# EAGLE design menu-superlistas-tofi (EAGLE 5.11)
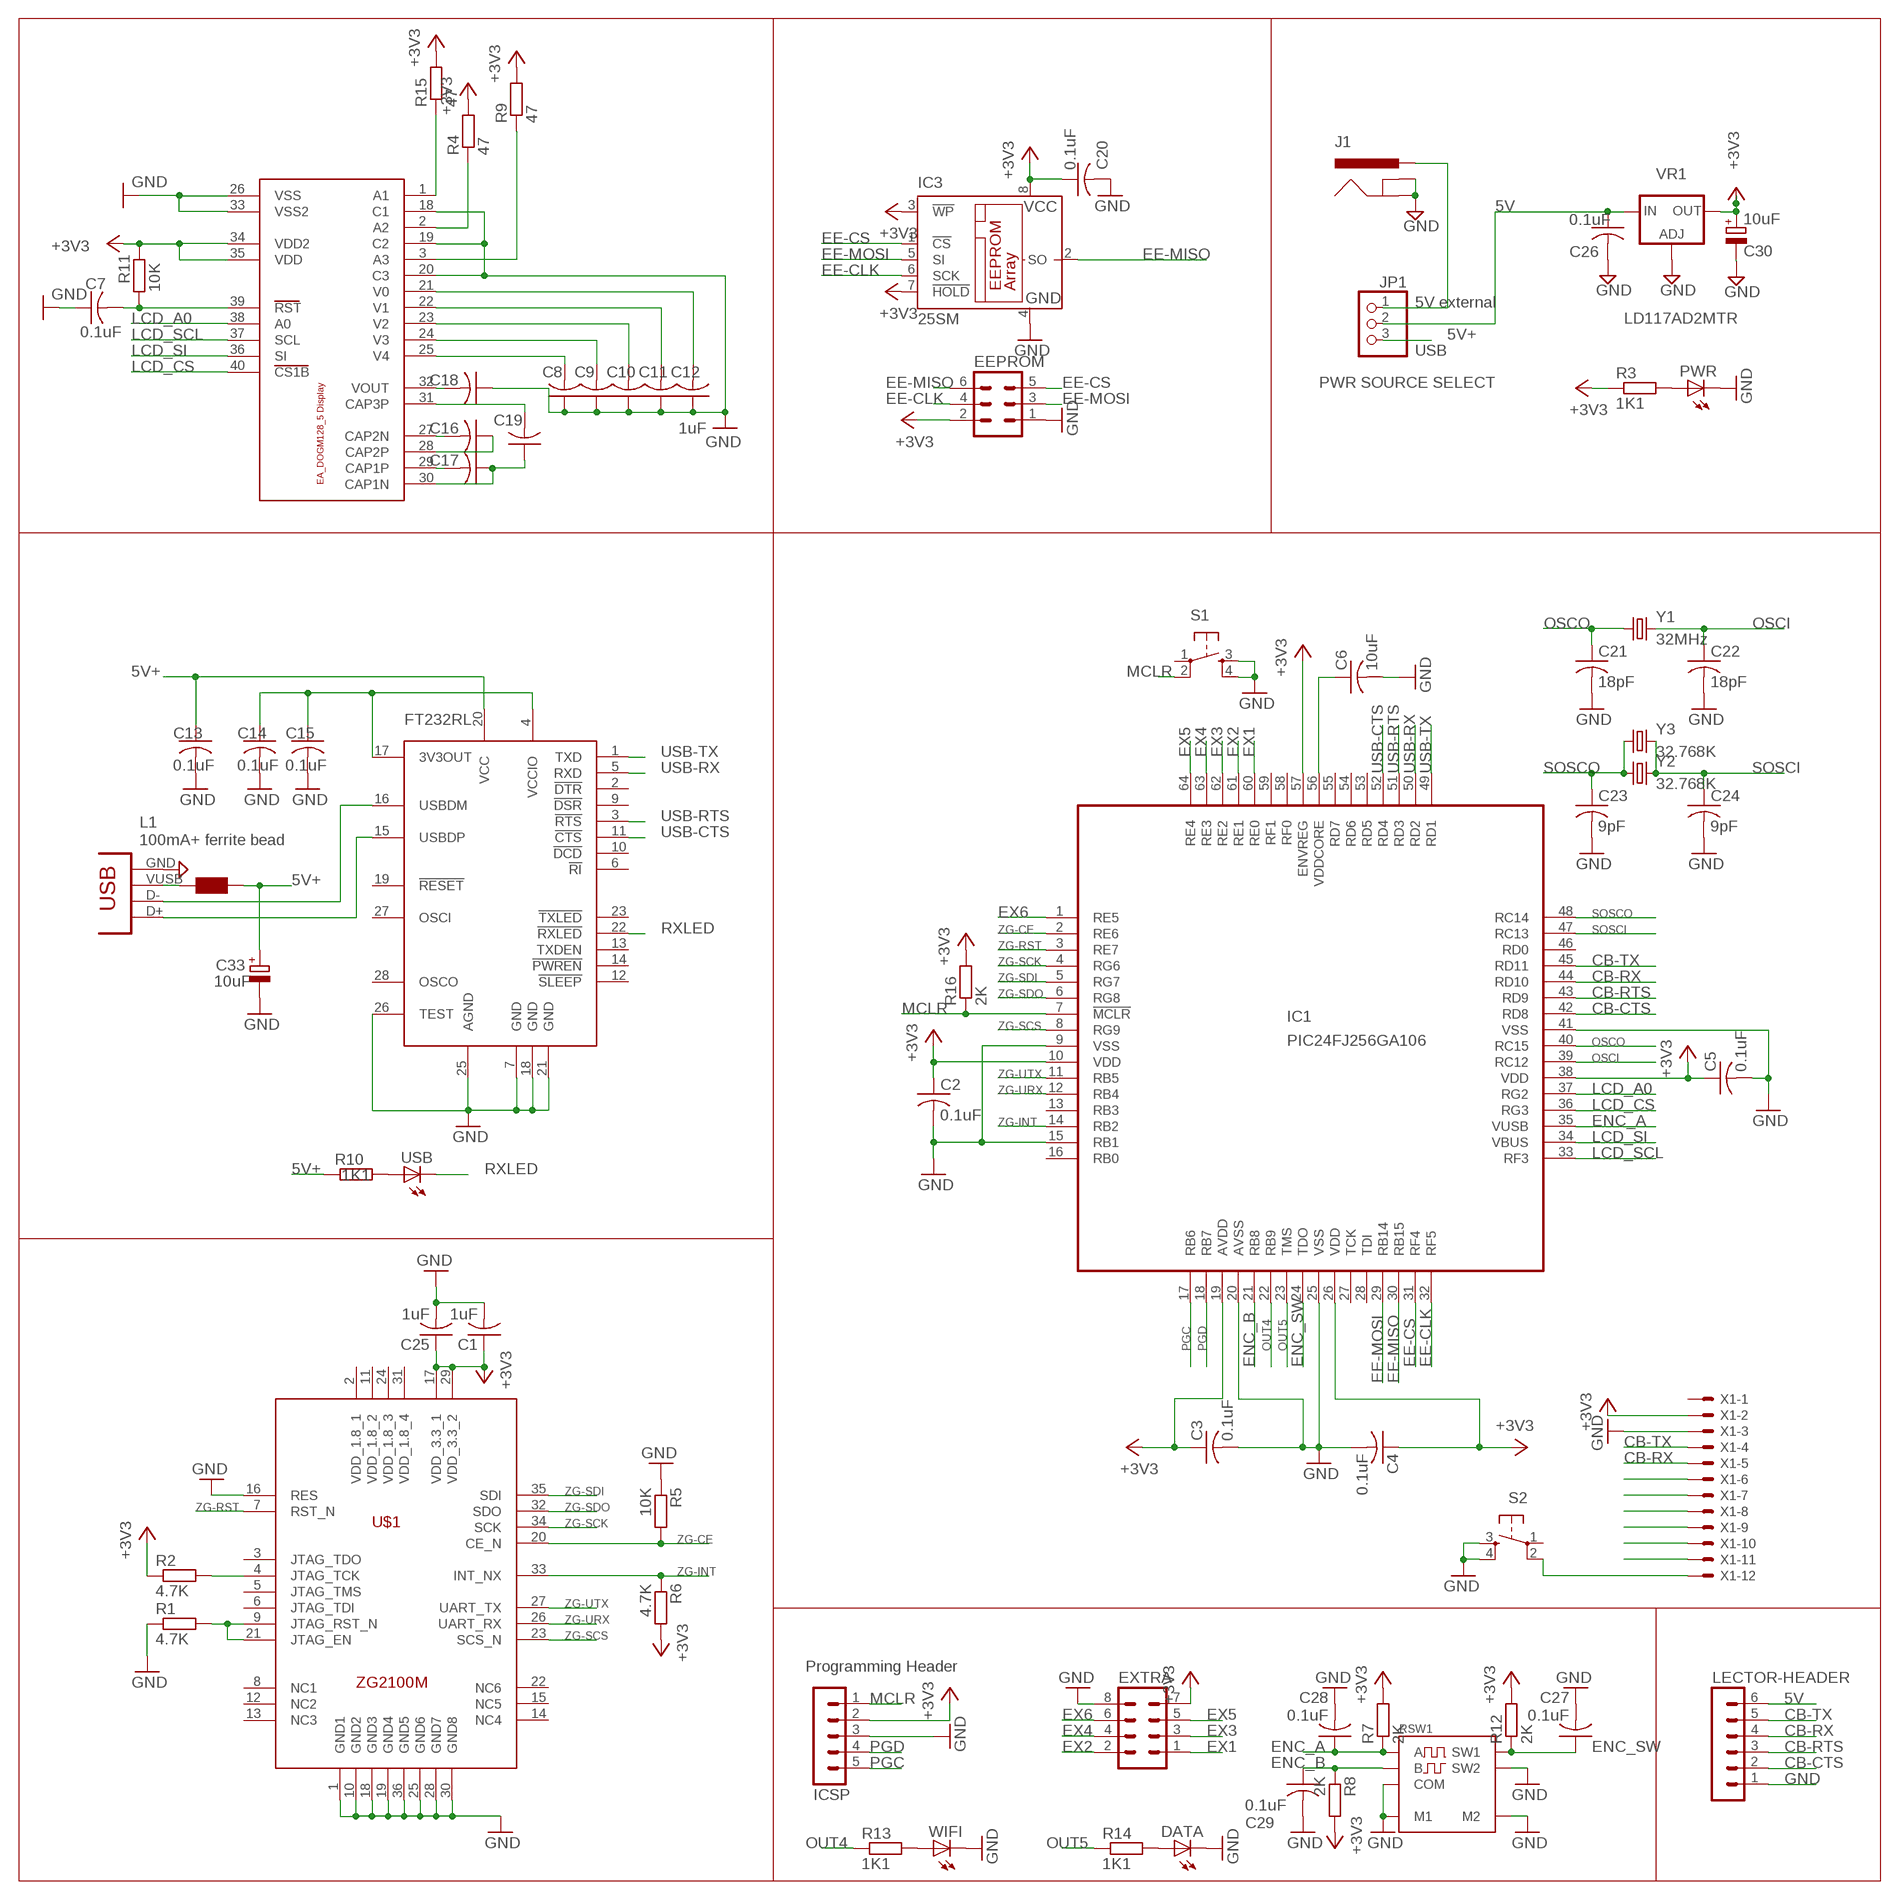
[diagram p0: schematic, sheet 1]

## Parts
C1  1uF  C-USC0805K  [C0805K]
C2  0.1uF  C-USC0805K  [C0805K]
C3  0.1uF  C-USC0805K  [C0805K]
C4  0.1uF  C-USC0805K  [C0805K]
C5  0.1uF  C-USC0805K  [C0805K]
C6  10uF  C-USC0805K  [C0805K]
C7  0.1uF  C-USC0805K  [C0805K]
C8  1uF  C-USC0805K  [C0805K]
C9  1uF  C-USC0805K  [C0805K]
C10  1uF  C-USC0805K  [C0805K]
C11  1uF  C-USC0805K  [C0805K]
C12  1uF  C-USC0805K  [C0805K]
C13  0.1uF  C-USC0805K  [C0805K]
C14  0.1uF  C-USC0805K  [C0805K]
C15  0.1uF  C-USC0805K  [C0805K]
C16  1uF  C-USC0805K  [C0805K]
C17  1uF  C-USC0805K  [C0805K]
C18  1uF  C-USC0805K  [C0805K]
C19  1uF  C-USC0805K  [C0805K]
C20  0.1uF  C-USC0805K  [C0805K]
C21  18pF  C-USC0805K  [C0805K]
C22  18pF  C-USC0805K  [C0805K]
C23  9pF  C-USC0805K  [C0805K]
C24  9pF  C-USC0805K  [C0805K]
C25  1uF  C-USC0805K  [C0805K]
C26  0.1uF  C-USC0805K  [C0805K]
C27  0.1uF  C-USC0805K  [C0805K]
C28  0.1uF  C-USC0805K  [C0805K]
C29  0.1uF  C-USC0805K  [C0805K]
C30  10uF  CPOL-EUSMCA  [SMC_A]
C33  10uF  CPOL-EUSMCA  [SMC_A]
CONN1  CONN_USB  [CONN_USB_MINI-B]
DATA  LEDCHIPLED_0805  [CHIPLED_0805]
EEPROM  MA03-2  [MA03-2]
EXTRA  MA04-2  [MA04-2]
IC1  PIC24FJ256GA106  PIC24FJ256GB106  [TQFP64-10X10]
IC3  25SM  [SO-08M]
IC4  FT232RL  [SSOP28]
ICSP  MA05-1  [MA05-1]
J1  POWER_JACKSMD  [POWER_JACK_SMD]
JP1  PINHD-1X03_2.54-S  [1X03-S]
L1  100mA+ ferrite bead  WE-KIL_0805  [WE-KI_0805_B]
LCD  EA_DOG-M_DISPLAY  [E_DOG-M_DISPLAY]
LECTOR-HEADER  MA06-1  [MA06-1]
PWR  LEDCHIPLED_0805  [CHIPLED_0805]
R1  4.7K  R-EU_R0805  [R0805]
R2  4.7K  R-EU_R0805  [R0805]
R3  1K1  R-EU_R0805  [R0805]
R4  47  R-EU_R0805  [R0805]
R5  10K  R-EU_R0805  [R0805]
R6  4.7K  R-EU_R0805  [R0805]
R7  2K  R-EU_R0805  [R0805]
R8  2K  R-EU_R0805  [R0805]
R9  47  R-EU_R0805  [R0805]
R10  1K1  R-EU_R0805  [R0805]
R11  10K  R-EU_R0805  [R0805]
R12  2K  R-EU_R0805  [R0805]
R13  1K1  R-EU_R0805  [R0805]
R14  1K1  R-EU_R0805  [R0805]
R15  47  R-EU_R0805  [R0805]
R16  2K  R-EU_R0805  [R0805]
RSW1  SW-EC11E  [EC11E]
S1  SMD_TACT_SMALL  [TACT_SWITCH_SMALL]
S2  SMD_TACT_SMALL  [TACT_SWITCH_SMALL]
U$1  ZG2100M  [ZG2100M]
USB  LEDCHIPLED_0805  [CHIPLED_0805]
VR1  LD117AD2MTR  [D2PACK]
WIFI  LEDCHIPLED_0805  [CHIPLED_0805]
X1  52745-1290  [52745-1290]
Y1  32MHz  TCX_7B_32TXC_7B_32  [TCX_7B_32]
Y2  32.768K  FSRLF  [FSRLF]
Y3  32.768K  ST325SB  [ST3215SB]

## Nets
5V [power]: C26.1 JP1.2 LECTOR-HEADER.6 VR1.3(IN)
5V+: C13.1 C33.+ IC4.20(VCC) JP1.3 L1.1 R10.2
$N26: CONN1.VUSB L1.2
+3V3 [power]: C1.1 C2.1 C3.1 C4.1 C5.1 C20.1 C25.1 C30.+ EEPROM.2 EXTRA.7 IC1.10(VDD) IC1.19(AVDD) IC1.26(VDD) IC1.38(VDD) IC1.57(ENVREG) IC3.3(!WP) IC3.7(!HOLD) IC3.8(VCC) ICSP.2 LCD.34(VDD2) LCD.35(VDD) R2.1 R3.1 R4.2 R6.2 R7.2 R8.2 R9.2 R11.2 R12.2 R15.2 R16.2 U$1.17(VDD_3.3_1) U$1.29(VDD_3.3_2) VR1.2(OUT) X1.2
CB-CTS: IC1.42(RD8) LECTOR-HEADER.2
CB-RTS: IC1.43(RD9) LECTOR-HEADER.3
CB-RX: IC1.44(RD10) LECTOR-HEADER.4 X1.5
CB-TX: IC1.45(RD11) LECTOR-HEADER.5 X1.4
EE-CLK: EEPROM.4 IC1.32(RF5) IC3.6(SCK)
EE-CS: EEPROM.5 IC1.31(RF4) IC3.1(!CS)
EE-MISO: EEPROM.6 IC1.30(RB15) IC3.2(SO)
EE-MOSI: EEPROM.3 IC1.29(RB14) IC3.5(SI)
ENC_A: C28.1 IC1.35(VUSB) R7.1 RSW1.A
ENC_B: C29.1 IC1.21(RB8) R8.1 RSW1.B
ENC_SW: C27.1 IC1.24(TDO) R12.1 RSW1.SW1
EX1: EXTRA.1 IC1.60(RE0)
EX2: EXTRA.2 IC1.61(RE1)
EX3: EXTRA.3 IC1.62(RE2)
EX4: EXTRA.4 IC1.63(RE3)
EX5: EXTRA.5 IC1.64(RE4)
EX6: EXTRA.6 IC1.1(RE5)
GND [power]: C1.2 C2.2 C3.2 C4.2 C5.2 C6.2 C7.1 C8.1 C9.1 C10.1 C11.1 C12.1 C13.2 C14.2 C15.2 C18.1 C20.2 C21.2 C22.2 C23.2 C24.2 C25.2 C26.2 C27.2 C28.2 C29.2 C30.- C33.- CONN1.GND DATA.C EEPROM.1 EXTRA.8 IC1.9(VSS) IC1.15(RB1) IC1.20(AVSS) IC1.25(VSS) IC1.41(VSS) IC3.4(GND) IC4.7(GND) IC4.18(GND) IC4.21(GND) IC4.25(AGND) IC4.26(TEST) ICSP.3 J1.GND(GNDBREAK) J1.P$4(GND) LCD.18(C1) LCD.19(C2) LCD.20(C3) LCD.26(VSS) LCD.33(VSS2) LECTOR-HEADER.1 PWR.C R1.1 R5.1 RSW1.C(COM) RSW1.M1 RSW1.M2 RSW1.SW2 S1.3 S1.4 S2.3 S2.4 U$1.1(GND1) U$1.10(GND2) U$1.16(RES) U$1.18(GND3) U$1.19(GND4) U$1.25(GND6) U$1.28(GND7) U$1.30(GND8) U$1.36(GND5) VR1.1(ADJ) WIFI.C X1.3
LCD_A0: IC1.37(RG2) LCD.38(A0)
LCD_CS: IC1.36(RG3) LCD.40(CS1B)
LCD_SCL: IC1.33(RF3) LCD.37(SCL)
LCD_SI: IC1.34(VBUS) LCD.36(SI)
MCLR: IC1.7(!MCLR) ICSP.1 R16.1 S1.2
N$1: R1.2 U$1.9(JTAG_RST_N) U$1.21(JTAG_EN)
N$2: PWR.A R3.2
N$3: R2.2 U$1.4(JTAG_TCK)
N$6: LCD.1(A1) R15.1
N$7: X1.6
N$8: X1.7
N$9 [power]: C6.1 IC1.56(VDDCORE)
N$10: LCD.2(A2) R4.1
N$11: R10.1 USB.A
N$12: C7.2 LCD.39(RST) R11.1
N$13: DATA.A R14.2
N$14: R13.2 WIFI.A
N$15: CONN1.D+ IC4.15(USBDP)
N$16: CONN1.D- IC4.16(USBDM)
N$17: C14.1 C15.1 IC4.4(VCCIO) IC4.17(3V3OUT)
N$18: LCD.3(A3) R9.1
N$19: X1.8
N$20: X1.9
N$21: C8.2 LCD.25(V4)
N$22: C9.2 LCD.24(V3)
N$23: C10.2 LCD.23(V2)
N$24: C11.2 LCD.22(V1)
N$25: C12.2 LCD.21(V0)
N$26: C16.2 LCD.27(CAP2N)
N$27: C16.1 LCD.28(CAP2P)
N$28: C17.2 LCD.29(CAP1P)
N$29: C17.1 C19.1 LCD.30(CAP1N)
N$30: C18.2 LCD.32(VOUT)
N$31: C19.2 LCD.31(CAP3P)
N$32: X1.10
N$33: X1.11
N$34: S2.2 X1.12
OSCI: C22.1 IC1.39(RC12) Y1.P$3
OSCO: C21.1 IC1.40(RC15) Y1.P$2
OUT4: IC1.22(RB9) R13.1
OUT5: IC1.23(TMS) R14.1
PGC: IC1.17(RB6) ICSP.5
PGD: IC1.18(RB7) ICSP.4
RXLED: IC4.22(!RXLED) USB.C
SOSCI: C24.1 IC1.47(RC13) Y2.P$4 Y3.P$2
SOSCO: C23.1 IC1.48(RC14) Y2.P$1 Y3.P$1
USB-CTS: IC1.52(RD4) IC4.11(!CTS)
USB-RTS: IC1.51(RD3) IC4.3(!RTS)
USB-RX: IC1.50(RD2) IC4.5(RXD)
USB-TX: IC1.49(RD1) IC4.1(TXD)
VEXT: J1.VIN0(PWR) JP1.1
ZG-CE: IC1.2(RE6) R5.2 U$1.20(CE_N)
ZG-INT: IC1.14(RB2) R6.1 U$1.33(INT_NX)
ZG-RST: IC1.3(RE7) U$1.7(RST_N)
ZG-SCK: IC1.4(RG6) U$1.34(SCK)
ZG-SCS: IC1.8(RG9) U$1.23(SCS_N)
ZG-SDI: IC1.5(RG7) U$1.35(SDI)
ZG-SDO: IC1.6(RG8) U$1.32(SDO)
ZG-URX: IC1.12(RB4) U$1.26(UART_RX)
ZG-UTX: IC1.11(RB5) U$1.27(UART_TX)
Unconnected: IC1.13(RB3) IC1.16(RB0) IC1.27(TCK) IC1.28(TDI) IC1.46(RD0) IC1.53(RD5) IC1.54(RD6) IC1.55(RD7) IC1.58(RF0) IC1.59(RF1) IC4.2(!DTR) IC4.6(!RI) IC4.9(!DSR) IC4.10(!DCD) IC4.12(!SLEEP) IC4.13(TXDEN) IC4.14(!PWREN) IC4.19(!RESET) IC4.23(!TXLED) IC4.27(OSCI) IC4.28(OSCO) S1.1 S2.1 U$1.2(VDD_1.8_1) U$1.3(JTAG_TDO) U$1.5(JTAG_TMS) U$1.6(JTAG_TDI) U$1.8(NC1) U$1.11(VDD_1.8_2) U$1.12(NC2) U$1.13(NC3) U$1.14(NC4) U$1.15(NC5) U$1.22(NC6) U$1.24(VDD_1.8_3) U$1.31(VDD_1.8_4) X1.1

## Notes on the sheet
- J1
- 5V external
- USB
- PWR SOURCE SELECT
- Programming Header

## Power pins joined to a net without a drawn wire
GND: Y1.P$1(GND) Y1.P$4(GND)

## Library data of the parts
C1 C3-C29 = rcl:C-US: CAPACITOR, American symbol
C2 = resistor:C-US: CAPACITOR, American symbol
C30 C33 = rcl:CPOL-EU: POLARIZED CAPACITOR, European symbol
CONN1 = dp_devices:CONN_USB: USB connector
DATA PWR USB WIFI = led:LED: LED OSRAM: - CHIPLED LG R971, LG N971, LY N971, LG Q971, LY Q971, LO R971, LY R971 LH N974, LH R974 LS Q976, LO Q976, LY Q976 LO Q996 - Hyper CHIPLED LW Q18S LB Q993, LB Q99A, LB R99A - SideLED LS A670, LO A670, LY A670, LG A670, LP A670 LB A673, LV A673, LT A673, LW A673 LH A674 LY A675 LS A676, LA A676, LO A676, LY A676, LW A676 LS A679, LY A679, LG A679 - Hyper Micro SIDELED® LS Y876, LA Y876, LO Y876, LY Y876 LT Y87S - SmartLED LW L88C, LW L88S LB L89C, LB L89S, LG L890 LS L89K, LO L89K, LY L89K LS L896, LA L896, LO L896, LY L896 - TOPLED LS T670, LO T670, LY T670, LG T670, LP T670 LSG T670, LSP T670, LSY T670, LOP T670, LYG T670 LG T671, LOG T671, LSG T671 LB T673, LV T673, LT T673, LW T673 LH T674 LS T676, LA T676, LO T676, LY T676, LB T676, LH T676, LSB T676, LW T676 LB T67C, LV T67C, LT T67C, LS T67K, LO T67K, LY T67K, LW E67C LS E67B, LA E67B, LO E67B, LY E67B, LB E67C, LV E67C, LT E67C LW T67C LS T679, LY T679, LG T679 LS T770, LO T770, LY T770, LG T770, LP T770 LB T773, LV T773, LT T773, LW T773 LH T774 LS E675, LA E675, LY E675, LS T675 LS T776, LA T776, LO T776, LY T776, LB T776 LHGB T686 LT T68C, LB T68C - Hyper Mini TOPLED® LB M676 - Mini TOPLED Santana® LG M470 LS M47K, LO M47K, LY M47K Source: http://www.osram.convergy.de LUXEON: - LUMILED® LXK2-PW12-R00, LXK2-PW12-S00, LXK2-PW14-U00, LXK2-PW14-V00 LXK2-PM12-R00, LXK2-PM12-S00, LXK2-PM14-U00 LXK2-PE12-Q00, LXK2-PE12-R00, LXK2-PE12-S00, LXK2-PE14-T00, LXK2-PE14-U00 LXK2-PB12-K00, LXK2-PB12-L00, LXK2-PB12-M00, LXK2-PB14-N00, LXK2-PB14-P00, LXK2-PB14-Q00 LXK2-PR12-L00, LXK2-PR12-M00, LXK2-PR14-Q00, LXK2-PR14-R00 LXK2-PD12-Q00, LXK2-PD12-R00, LXK2-PD12-S00 LXK2-PH12-R00, LXK2-PH12-S00 LXK2-PL12-P00, LXK2-PL12-Q00, LXK2-PL12-R00 Source: www.luxeon.com KINGBRIGHT: KA-3528ASYC Source: www.kingbright.com
EEPROM = con-lstb:MA03-2: PIN HEADER
EXTRA = con-lstb:MA04-2: PIN HEADER; OC_FARNELL: unknown; OC_NEWARK: unknown
IC1 = microchip:PIC24FJ256GB106: PIC24FJ256GB106 edit this description Auto generated by make-symbol-device-package-bsdl.ulp Rev. 25 Source: PIC24FJ256GB106.bsd; MPN: PIC24FJ256GB106-I/PT; OC_FARNELL: 1576868; OC_NEWARK: 54M5129
IC3 = microchip:25*: Serial EEPROM 4 K, SPI bus
IC4 = dp_devices:FT232RL: USB to serial UART interface
ICSP = con-lstb:MA05-1: PIN HEADER
J1 = SparkFun:POWER_JACK: Power Jack This is the standard 5.5mm barrel jack for power. The PTH is the most common, proven, reliable, footprint. All others are experimental. The Slot footprint only works if the mill layer is transmitted to the PCB fab house so be warned. Spark Fun Electronics SKU : PRT-00119. Mating wall wart : TOL-00298 (and others)
JP1 = pinhead-2:PINHD-1X03: PIN HEADER
L1 = wuerth-elektronik:WE-KIL: SMD Wire Wound Ceramic Inductor WE-KIL - Low profile - High Q values -- Bluetooth -- Wireless LAN -- RF oscillation circuit -- IF impedance matching
LCD = display_ea_dogm128:EA_DOG-M_DISPLAY
LECTOR-HEADER = con-lstb:MA06-1: PIN HEADER; OC_FARNELL: unknown; OC_NEWARK: unknown
R1-R16 = resistor:R-EU_: RESISTOR, European symbol
RSW1 = SuperListas:SW-EC11*
S1 S2 = dp_devices:SMD_TACT_SMALL
U$1 = SparkFun:ZG2100M
VR1 = v-reg:LD117A?*: Low drop fixed and adjustable positive voltage regulators 1 A Source: http://www.st.com/stonline/products/literature/ds/7194/ld1117axx.pdf
X1 = con-molex:52745-1290: FFC/FPC-to-Board 0.50mm (.020") SMT Top Contact Right Angle, ZIF, Style Receptacle 52745 / 52435 Source: http://www.molex.com/product/ffc/52745.html; MPN: 52745-1290; OC_FARNELL: unknown; OC_NEWARK: 92M6383
Y1 = SuperListas:TCX_7B_32
Y2 = SuperListas:FSRLF
Y3 = SuperListas:ST325SB

## Net classes
1 power: width 0.254 mm

## Board
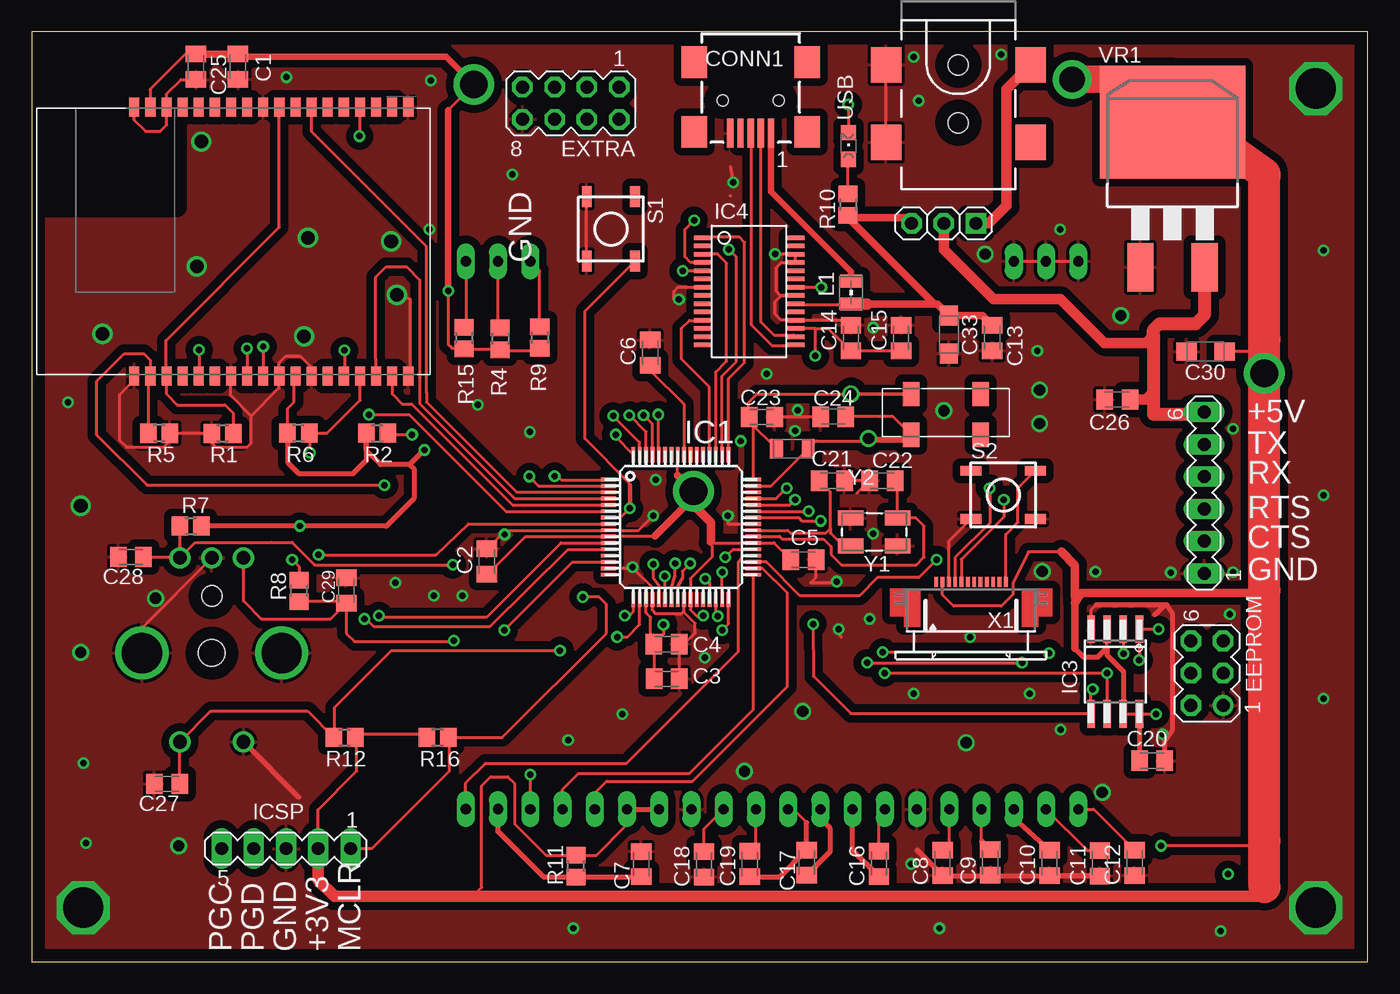
[diagram p1: board, top side]
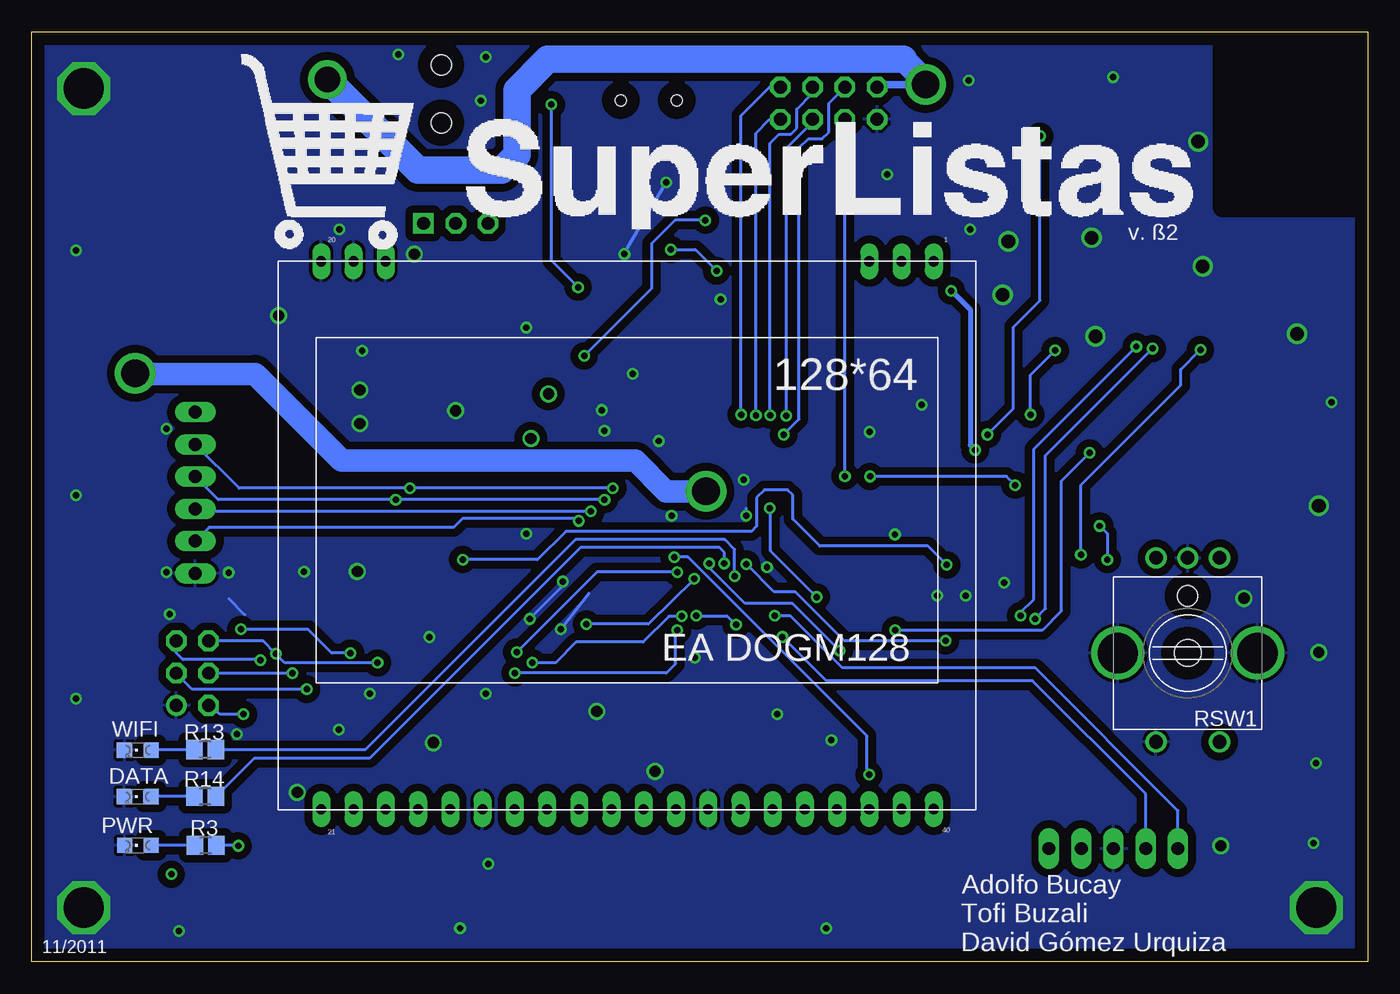
[diagram p2: board, bottom side, seen from below]

Size 105.28 x 73.29 mm. Coordinates in mm from the lower left corner, seen from the top.
Outline: 0,0 105.28,0 105.28,73.29 0,73.29 0,0
Copper layers (1*16): Top 0.035mm / dielectric 1.5mm / Bottom 0.035mm
Design rules "default *": minimum track width 7mil, minimum drill 20mil, track to track 7mil, track to pad 7mil, pad to pad 7mil, via to via 7mil, smd to smd 7mil, copper to edge 40mil, drill to drill 8mil, minimum pad ring 12mil, minimum via ring 8mil, stop-mask expansion 7mil, vias tented up to drill 25mil, thermal gap 10mil
tRestrict: area 0.1,59.5 to 11.4,80.1
bRestrict: area 0.1,59.5 to 11.4,80.1

### Footprints (pad centres in the part's own frame; a part is rotated, then mirrored left to right if it is on the bottom)
C0805K = smd 1.3 x 1.6: 1 -1,0; 2 1,0
SMC_A = smd 1.6 x 1.4: + -1.5,0; - 1.5,0
CONN_USB_MINI-B = smd 0.5 x 2.3: D+ 0,2.6; D- -0.8,2.6; GND 1.6,2.6; P4 0.8,2.6; VUSB -1.6,2.6 | smd 2 x 2.5: PC1 -4.45,2.5; PC2 4.45,2.5; PC3 4.45,-3; PC4 -4.45,-3 | hole 0.9: -2.2,0; 2.2,0
CHIPLED_0805 = smd 1.2 x 1.2: A 0,-1.05; C 0,1.05
MA03-2 = drill 1.016 round: 1 -2.54,-1.27 | drill 1.016 octagon: 2 -2.54,1.27; 3 0,-1.27; 4 0,1.27; 5 2.54,-1.27; 6 2.54,1.27
MA04-2 = drill 1.016 octagon: 1 -3.81,-1.27; 2 -3.81,1.27; 3 -1.27,-1.27; 4 -1.27,1.27; 5 1.27,-1.27; 6 1.27,1.27; 7 3.81,-1.27; 8 3.81,1.27
TQFP64-10X10 = smd 1.2 x 0.3: 1 -5.7,3.75; 2 -5.7,3.25; 3 -5.7,2.75; 4 -5.7,2.25; 5 -5.7,1.75; 6 -5.7,1.25; 7 -5.7,0.75; 8 -5.7,0.25; 9 -5.7,-0.25; 10 -5.7,-0.75; 11 -5.7,-1.25; 12 -5.7,-1.75; 13 -5.7,-2.25; 14 -5.7,-2.75; 15 -5.7,-3.25; 16 -5.7,-3.75; 33 5.7,-3.75; 34 5.7,-3.25; 35 5.7,-2.75; 36 5.7,-2.25; 37 5.7,-1.75; 38 5.7,-1.25; 39 5.7,-0.75; 40 5.7,-0.25; 41 5.7,0.25; 42 5.7,0.75; 43 5.7,1.25; 44 5.7,1.75; 45 5.7,2.25; 46 5.7,2.75; 47 5.7,3.25; 48 5.7,3.75 | smd 0.3 x 1.2: 17 -3.75,-5.7; 18 -3.25,-5.7; 19 -2.75,-5.7; 20 -2.25,-5.7; 21 -1.75,-5.7; 22 -1.25,-5.7; 23 -0.75,-5.7; 24 -0.25,-5.7; 25 0.25,-5.7; 26 0.75,-5.7; 27 1.25,-5.7; 28 1.75,-5.7; 29 2.25,-5.7; 30 2.75,-5.7; 31 3.25,-5.7; 32 3.75,-5.7; 49 3.75,5.7; 50 3.25,5.7; 51 2.75,5.7; 52 2.25,5.7; 53 1.75,5.7; 54 1.25,5.7; 55 0.75,5.7; 56 0.25,5.7; 57 -0.25,5.7; 58 -0.75,5.7; 59 -1.25,5.7; 60 -1.75,5.7; 61 -2.25,5.7; 62 -2.75,5.7; 63 -3.25,5.7; 64 -3.75,5.7
SO-08M = smd 0.6 x 2.2: 1 -1.905,-3.33; 2 -0.635,-3.33; 3 0.635,-3.33; 4 1.905,-3.33; 5 1.905,3.33; 6 0.635,3.33; 7 -0.635,3.33; 8 -1.905,3.33
SSOP28 = smd 0.348 x 1.397: 1 -4.225,-3.656; 2 -3.575,-3.656; 3 -2.925,-3.656; 4 -2.275,-3.656; 5 -1.625,-3.656; 6 -0.975,-3.656; 7 -0.325,-3.656; 8 0.325,-3.656; 9 0.975,-3.656; 10 1.625,-3.656; 11 2.275,-3.656; 12 2.925,-3.656; 13 3.575,-3.656; 14 4.225,-3.656; 15 4.225,3.656; 16 3.575,3.656; 17 2.925,3.656; 18 2.275,3.656; 19 1.625,3.656; 20 0.975,3.656; 21 0.325,3.656; 22 -0.325,3.656; 23 -0.975,3.656; 24 -1.625,3.656; 25 -2.275,3.656; 26 -2.925,3.656; 27 -3.575,3.656; 28 -4.225,3.656
MA05-1 = drill 1.016 long: 1 -5.08,0; 2 -2.54,0; 3 0,0; 4 2.54,0; 5 5.08,0
POWER_JACK_SMD = smd 2.8 x 2.4: GND 0,-5.7; P$4 6.1,-5.7; VIN0 0,5.7; VIN1 6.1,5.7 | hole 1.6: 0,0; 4.572,0
1X03-S = drill 1.016 square: 1 -2.54,0 | drill 1.016 octagon: 2 0,0; 3 2.54,0
WE-KI_0805_B = smd 1.02 x 1.78: 1 -0.89,0; 2 0.89,0
E_DOG-M_DISPLAY = drill 0.8 long: 1 -22.828,-20.32; 2 -20.288,-20.32; 3 -17.748,-20.32; 18 20.352,-20.32; 19 22.892,-20.32; 20 25.432,-20.32; 21 25.432,22.86; 22 22.892,22.86; 23 20.352,22.86; 24 17.812,22.86; 25 15.272,22.86; 26 12.732,22.86; 27 10.192,22.86; 28 7.652,22.86; 29 5.112,22.86; 30 2.572,22.86; 31 0.032,22.86; 32 -2.508,22.86; 33 -5.048,22.86; 34 -7.588,22.86; 35 -10.128,22.86; 36 -12.668,22.86; 37 -15.208,22.86; 38 -17.748,22.86; 39 -20.288,22.86; 40 -22.828,22.86
MA06-1 = drill 1.016 long: 1 -6.35,0; 2 -3.81,0; 3 -1.27,0; 4 1.27,0; 5 3.81,0; 6 6.35,0
R0805 = smd 1.3 x 1.5: 1 -0.85,0; 2 0.85,0
EC11E = drill 1.067 pad 1.676 round: A -2.5,-7.5; B 2.5,-7.5; C 0,-7.5; SW1 -2.5,7; SW2 2.5,7 | drill 3.175 round: M1 -5.5,0; M2 5.5,0 | hole 1.6: 0,-4.5 | hole 2.1: 0,0
TACT_SWITCH_SMALL = smd 1.651 x 0.762: 1 -2.54,1.905; 2 2.54,1.905; 3 -2.54,-1.905; 4 2.54,-1.905
ZG2100M = smd 1.5 x 0.8: 1 21.1,1.7; 2 21.1,2.97; 3 21.1,4.24; 4 21.1,5.51; 5 21.1,6.78; 6 21.1,8.05; 7 21.1,9.32; 8 21.1,10.59; 9 21.1,11.86; 10 21.1,13.13; 11 21.1,14.4; 12 21.1,15.67; 13 21.1,16.94; 14 21.1,18.21; 15 21.1,19.48; 16 21.1,20.75; 17 21.1,22.02; 18 21.1,23.29; 19 -0.1,23.29; 20 -0.1,22.02; 21 -0.1,20.75; 22 -0.1,19.48; 23 -0.1,18.21; 24 -0.1,16.94; 25 -0.1,15.67; 26 -0.1,14.4; 27 -0.1,13.13; 28 -0.1,11.86; 29 -0.1,10.59; 30 -0.1,9.32; 31 -0.1,8.05; 32 -0.1,6.78; 33 -0.1,5.51; 34 -0.1,4.24; 35 -0.1,2.97; 36 -0.1,1.7
D2PACK = smd 2.083 x 3.81: 1 -2.54,-8.89; 3 2.54,-8.89 | smd 11.43 x 8.89: 2 0,2.54
52745-1290 = smd 0.3 x 0.8: 1 -2.75,2.5; 2 -2.25,2.5; 3 -1.75,2.5; 4 -1.25,2.5; 5 -0.75,2.5; 6 -0.25,2.5; 7 0.25,2.5; 8 0.75,2.5; 9 1.25,2.5; 10 1.75,2.5; 11 2.25,2.5; 12 2.75,2.5
TCX_7B_32 = smd 2 x 1.2: P$1 -1.85,1.1; P$2 1.85,1.1; P$3 -1.85,-1.1; P$4 1.85,-1.1
FSRLF = smd 1.3 x 1.9: P$1 -2.54,1.27; P$2 2.94,1.27; P$3 2.94,-1.94; P$4 -2.54,-1.94
ST3215SB = smd 1 x 1.55: P$1 -1.25,0; P$2 1.25,0

### Placement (x,y rotation side)
C1  16.25,70.56 270 top
C2  35.86,31.55 90 top
C3  50.04,22.31 0 top
C4  50.04,25.04 0 top
C5  60.8,31.69 0 top
C6  48.74,48.01 90 top
C7  48.03,7.7 270 top
C8  71.77,7.8 90 top
C9  75.53,7.83 90 top
C10  80.2,7.79 90 top
C11  84.17,7.77 90 top
C12  86.9,7.81 90 top
C13  75.69,49.17 270 top
C14  64.56,49.17 90 top
C15  68.5,49.17 90 top
C16  66.76,7.73 90 top
C17  61.07,7.82 270 top
C18  52.97,7.68 90 top
C19  56.58,7.71 90 top
C20  88.29,15.85 0 top
C21  63.06,37.92 0 top
C22  67.02,37.91 180 top
C23  57.54,42.94 0 top
C24  63.16,42.97 180 top
C25  12.94,70.54 270 top
C26  85.55,44.32 180 top
C27  10.67,14.02 180 top
C28  7.82,31.9 180 top
C29  24.79,29.26 90 top
C30  92.49,48.1 180 top
C33  72.28,49.44 270 top
CONN1  56.66,67.9 180 top
DATA  96.93,13.02 90 bottom
EEPROM  92.62,22.75 90 top
EXTRA  42.48,67.67 180 top
IC1  51.16,34.26 0 top
IC3  85.37,22.88 180 top
IC4  56.53,52.84 270 top
ICSP  20.04,8.92 180 top
J1  73.01,70.7 270 top
JP1  71.87,58.2 180 top
L1  64.57,52.74 90 top
LCD  57.03,34.89 180 bottom
LECTOR-HEADER  92.39,36.97 90 top
PWR  96.92,9.18 90 bottom
R1  15.04,41.65 0 top
R2  27.22,41.66 0 top
R3  91.59,9.17 180 bottom
R4  36.92,49.1 270 top
R5  10.04,41.66 180 top
R6  21.01,41.66 180 top
R7  12.54,34.35 0 top
R8  21.07,29.23 90 top
R9  40.04,49.19 270 top
R10  64.33,59.66 270 top
R11  42.89,7.55 90 top
R12  24.66,17.68 0 top
R13  91.61,16.72 180 bottom
R14  91.61,13.03 180 bottom
R15  34.07,49.16 270 top
R16  31.99,17.67 180 top
RSW1  14.19,24.33 180 bottom
S1  45.63,57.76 270 top
S2  76.56,36.8 0 top
U$1  31.38,46.27 90 top
USB  64.36,64.3 0 top
VR1  89.9,63.62 0 top
WIFI  96.92,16.69 90 bottom
X1  74.02,27.43 0 top
Y1  66.38,33.88 180 top
Y2  71.84,43.48 0 top
Y3  59.94,40.44 0 top

### Tracks (layer width: path | path; a pad name or v marks a point on that pad's centre or on a via)
5V
  Top 0.61: 89.41,50.29 89.31,50.19 | 88.39,43.16 88.39,43.15 | 88.39,49.17 87.99,48.77
  Top 0.813: 88.39,49.38 87.78,48.77 84.53,48.77 81.08,52.22 75.79,52.22 71.87,56.15 JP1.2 | C26.1 87.8,44.32 88.39,44.91
  Top 1.016: VR1.3 92.44,51.01 91.72,50.29 89.41,50.29 88.88,50.29 88.39,49.81 88.39,49.38 88.39,49.17 88.39,44.91 88.39,43.16 92.39,43.16 LECTOR-HEADER.6
5V+
  Top 0.254: IC4.20 60.7,51.86 60.75,51.81 64.53,51.81 L1.1
  Top 0.61: C13.1 74.92,50.94 C33.+ 71.37,51.85 71.12,51.85 | 65.8,51.85 71.12,51.85 | 64.33,58.64 R10.2 | 71.12,51.85 64.33,58.64 | 64.33,58.64 68.89,58.64 JP1.3
  Top 0.914: L1.1 65.8,51.85
$N26
  Top 0.508: L1.2 64.57,54.42 58.27,60.72 58.27,65.49 CONN1.VUSB
+3V3  (via drill 0.51, 0.51 pad 0.25, 2.03 pad 0.25, 2.18, 2.18 pad 0.25)
  Top 0.254: IC3.7 IC3.8 | IC1.38 58.48,33.01 C5.1 59.8,31.26 | IC3.8 88.55,19.55 v88.59,19.51 | 84.73,24.74 IC3.3 | 87.29,16.56 C20.1 | IC3.8 | 22.61,7.73 ICSP.2 22.55,8.94 22.55,11.99 25.6,15.04 25.6,17.59 R12.2 25.6,17.97 30.84,17.97 R16.2 31.03,17.97 | C3.1 C4.1 | IC1.19 48.41,27.51 48.77,27.15 48.77,25.31 C4.1 | v52.91,27.28 52.43,27.28 | v52.91,27.28 52.98,27.28 | v49.78,26.57 49.78,25.79 C4.1 | 35.18,5.16 35.28,5.36 | IC1.57 50.91,38.32 | 49.12,33.55 49.12,33.53 45.53,33.53 IC1.10 45.42,33.48 38.86,33.48 35.99,30.6 C2.1 35.39,30.08 | 82.22,28.52 82.22,28.8 | IC1.38 58.51,33.01 59.97,31.55 | 97.13,29.29 96.95,29.11 | 96.09,49.15 96.09,49.51 | C30.+ 96.18,48.1 97.13,49.05 | 97.13,62.11 97.13,61.91 | IC1.38 53.71,33.01 53.54,33.18 | 53.37,33.01 53.62,32.77 53.62,31.92 51.9,30.2 IC1.26 51.91,27.75 52.43,27.23 52.86,27.23 v52.91,27.28 | U$1.29 20.68,46.06 20.68,44.12 20.16,43.61 R6.2 20.22,41.6 | C25.1 12.1,71.54 9.32,68.76 9.32,67.4 U$1.17 | X1.2 71.77,28.92 72.64,28.04 76.4,28.04 77.32,28.96 77.32,29.87 78.54,32.31 81.1,32.31 81.13,32.33 | R8.2 21.07,31.15 v20.52,31.7 | 90.07,69.55 89.61,69.49 89.61,67.99 89.9,67.46 | LCD.35 46.9,10.74 46.84,10.74 44.49,8.39 R11.2 40.52,8.39 38.05,10.87 38.05,14.05 37.52,14.58 36.17,14.58 35.46,13.87 35.46,5.86 34.75,5.15 | 34.09,68.38 32.82,67.11 | R9.2 39.85,48.16 36.37,48.16 36.47,48.25 R4.2 36.87,48.31 R15.2 34.02,48.36 33.12,48.36 32.82,48.67 v32.82,52.88 | v89,9.14 96.93,9.14 97.13,9.55 | 96.9,5.18 97.1,5.66 97.13,5.89
  Top 0.406: IC3.7 86.01,22.91 84.73,24.18 84.73,24.74 84.02,24.03 82.88,24.03 82.22,24.69 | IC3.8 87.29,16.56 | LCD.35 LCD.34 | v34.85,69.14 34.82,69.11 | 97.13,45.87 96.09,49.15 | 53.54,33.18 53.37,33.01 | 97.13,28.3 96.62,29.06 | 20.22,41.6 20.22,39.32 21.08,38.46 25.3,38.46 26.37,39.53 R2.1 26.37,40.31 27.48,39.19 29.79,39.19 | v30.94,40.34 29.79,39.19 | 29.79,39.19 30.12,38.86 30.12,36.52 27.95,34.35 v21.13,34.35 R7.2
  Top 0.508: 34.09,68.38 v34.85,69.14 32.64,71.35 16.54,71.35 | 32.82,67.11 v32.82,52.88
  Top 0.61: 82.22,24.69 82.22,28.3 82.22,28.52 | VR1.2 89.9,67.46 89.9,69.97 | 50.91,38.32 v52.15,37.08 52.15,36.58 49.12,33.55 | C25.1 16.35,71.54 16.54,71.35 15.96,71.35 C1.1
  Top 0.66: 52.15,36.58 52.15,36.02 53.54,34.62 53.54,33.18 | 96.62,29.06 82.73,29.06 82.22,28.3 | 82.22,28.8 82.22,31.24 81.13,32.33
  Top 0.914: 96.9,5.18 35.18,5.16 35.17,5.15 34.75,5.15 23.87,5.15 22.58,6.44 ICSP.2
  Top 1.27: 90.22,66.17 VR1.2
  Top 2.184: 90.07,69.55 v81.99,69.55
  Top 2.54: 91.44,66.17 90.22,66.17 | 91.44,66.17 91.75,66.17 | 97.13,61.91 97.13,49.05 v97.13,46.38 97.13,45.87 97.13,29.29 97.13,28.3 97.13,9.55 97.13,5.89 | 97.13,62.11 91.44,66.17
  Bottom 0.254: v88.59,19.51 90.39,19.51 EEPROM.2 | v52.91,27.28 50.49,27.28 v49.78,26.57 | 38.47,69.14 EXTRA.7 | v20.52,31.7 20.52,33.74 v21.13,34.35 | R3.1 89.03,9.17 v89,9.14
  Bottom 0.406: v30.94,40.34 31.33,40.73 31.33,51.4 v32.82,52.88
  Bottom 0.61: v34.85,69.14 38.47,69.14
  Bottom 1.778: v52.15,37.08 55.3,37.08 57.71,39.5 80.85,39.5 87.68,46.33 97.38,46.33 v97.13,46.38
  Bottom 1.93: 36.58,71.12 34.85,69.39 v34.85,69.14
  Bottom 2.184: v81.99,69.55 74.83,62.38 68.28,62.38 67.06,63.6 67.06,68.68 64.62,71.12 36.58,71.12
CB-CTS  (via drill 0.51)
  Top 0.254: IC1.42 60.44,35.01 60.71,34.75 v62.18,34.75
  Bottom 0.254: LECTOR-HEADER.2 91.31,34.24 72.03,34.24 71.32,34.95 62.38,34.95 v62.18,34.75
CB-RTS  (via drill 0.51)
  Top 0.254: IC1.43 61.41,35.51 v61.21,35.51
  Bottom 0.254: v61.21,35.51 92.2,35.51 LECTOR-HEADER.3
CB-RX  (via drill 0.51)
  Top 0.254: IC1.44 59.73,36.01 v60.15,36.42 | X1.5 73.26,29.94 73.26,31.72 76.61,35.06 v76.61,36.42
  Bottom 0.254: LECTOR-HEADER.4 90.57,36.42 v76.61,36.42 v60.15,36.42
CB-TX  (via drill 0.51, 0.51 pad 0.61)
  Top 0.254: IC1.45 58.66,36.51 v59.49,37.34 | X1.4 72.8,29.97 | v75.49,37.34 75.49,34.57 72.77,31.85 X1.4 | X1.4 72.79,29.96
  Bottom 0.254: LECTOR-HEADER.5 88.95,37.34 v75.49,37.34 v59.49,37.34
EE-CLK  (via drill 0.51, 0.51 pad 0.25)
  Top 0.254: IC3.6 v84.73,22.76 v67.21,22.76 | IC1.32 54.91,26.64 v54.41,26.14
  Bottom 0.254: EEPROM.4 84.74,22.75 v84.73,22.76 | v54.41,26.14 54.53,26.14 54.53,23.5 55.27,22.76 v67.21,22.76
EE-CS  (via drill 0.51)
  Top 0.254: v87.27,23.77 IC3.1 v88.8,26.21 | IC1.31 54.41,30.48 v54.41,30.71 | v67.06,24.41 80.09,24.41 v80.16,24.33
  Bottom 0.254: EEPROM.5 93.89,24.34 93.37,23.82 87.33,23.82 v87.27,23.77 | v54.41,30.71 60.73,30.73 v67.06,24.41 | v80.16,24.33 81.64,24.33 83.52,26.21 v88.8,26.21
EE-MISO  (via drill 0.51)
  Top 0.254: v86.06,24.28 86.06,26.17 IC3.2 | IC1.30 53.91,27.37 v54.05,27.23 | v65.84,23.57 v78.03,23.57
  Bottom 0.254: EEPROM.6 87.06,25.29 v86.06,24.28 85.34,23.57 v78.03,23.57 | v54.05,27.23 55.07,27.23 57.1,25.2 62.38,25.2 64.01,23.57 v65.84,23.57
EE-MOSI  (via drill 0.51)
  Top 0.254: v83.62,21.49 83.47,21.34 IC3.5 83.45,19.57 64.56,19.57 61.59,22.53 v61.57,26.62 | IC1.29 53.41,29.9 v53.07,30.18
  Bottom 0.254: v83.62,21.49 92.62,21.49 EEPROM.3 | v53.07,30.18 56.69,26.62 v61.57,26.62
ENC_A  (via drill 0.51)
  Top 0.254: RSW1.A 12.9,33.05 18.87,33.05 18.89,33.06 20.53,33.06 22.3,31.29 v33.17,31.29 | R7.1 RSW1.A | C28.1 11.62,31.9 RSW1.A | IC1.35 57.9,31.51 60.55,28.85 65.23,28.85 66.65,30.28 69.9,30.28 v71.32,31.7
  Bottom 0.254: v33.17,31.29 34.65,32.77 43.18,32.77 45.31,34.9 45.31,36.78 45.72,37.19 47.55,37.19 48.16,36.58 48.16,34.34 48.56,33.93 63.2,33.93 65.43,31.7 v71.32,31.7
ENC_B  (via drill 0.51)
  Top 0.254: v33.27,25.3 33.22,25.25 25.43,25.25 24.79,25.89 C29.1 | IC1.21 49.43,28.58 49.43,29.67 48.97,30.28 v48.97,31.34 | C29.1 24.91,28.38 | C29.1 23.55,27.03 18.09,27.03 16.69,28.42 RSW1.B | R8.1 24.67,28.38 C29.1
  Bottom 0.254: v33.27,25.3 41.25,25.3 45.11,29.16 46.79,29.16 v48.97,31.34
ENC_SW  (via drill 0.51)
  Top 0.254: R12.1 23.53,17.82 | IC1.24 50.91,29.57 51.28,30.25 51.28,30.79 v51.89,31.39 | v41.63,24.54 28.35,24.54 23.85,20.04 23.85,17.72 R12.1 | R12.1 23.85,17.92 | R12.1 21.73,19.76 14.12,19.76 RSW1.SW1 11.67,17.31 C27.1
  Bottom 0.254: v51.89,31.39 51.74,30.91 49.07,28.25 45.34,28.25 v41.63,24.54
EX1  (via drill 0.51)
  Top 0.254: IC1.60 49.41,43.1 v49.38,43.13
  Bottom 0.254: v49.38,43.13 49.38,66.69 47.13,68.94 EXTRA.1
EX2  (via drill 0.51)
  Top 0.254: IC1.61 48.91,42.38 v48.21,43.08
  Bottom 0.254: v48.21,43.08 48.21,65.32 47.13,66.4 EXTRA.2
EX3  (via drill 0.51)
  Top 0.254: IC1.62 48.41,41.76 v47.09,43.08
  Bottom 0.254: v47.09,43.08 47.09,64.52 46.38,65.23 45.47,65.23 44.98,65.71 44.98,67.21 43.75,68.44 EXTRA.3
EX4  (via drill 0.51)
  Top 0.254: IC1.63 47.91,40.94 v45.82,43.03
  Bottom 0.254: v45.82,43.03 45.82,64.11 43.75,66.18 EXTRA.4
EX5  (via drill 0.51)
  Top 0.254: 47.4,40.39 47.4,39.93 47.41,40.35 IC1.64 46.02,41.34 v46.02,41.55
  Bottom 0.254: v46.02,41.55 44.81,42.77 44.81,64.16 44.09,64.87 43,64.87 42.47,65.41 42.47,67.67 41.21,68.92 EXTRA.5
EX6  (via drill 0.51)
  Top 0.254: IC1.1 45.42,37.97 41.76,37.97 41.45,38.28 v41.2,38.28
  Bottom 0.254: v41.2,38.28 41.21,38.37 EXTRA.6
GND  (via drill 0.51, 0.89, 0.89 pad 0.05, 1.07, 3.17, 3.17 pad 3.78)
  Top 0.254: J1.P$4 J1.GND | 66.02,37.92 | C22.2 66.02,37.92 | 66.02,37.92 C21.2 | 66.02,37.92 65.03,36.94 | 60.05,55.11 IC4.25 IC4.26 60.17,55.78 v58.57,55.78 | 60.05,55.11 60,55.16 | 60.05,55.11 59.09,55.11 58.67,54.69 58.67,52.82 58.98,52.51 IC4.21 59.07,52.51 58.58,52.02 58.58,51.03 59.05,50.56 IC4.18 64.08,50.56 C14.2 | LCD.20 LCD.19 LCD.18 | 89.29,17.51 v89.1,17.93 89.41,17.53 | 83.87,28.14 83.46,27.74 IC3.4 | VR1.1 87.03,54.41 | C24.2 58.57,42.97 C23.2 | 55.06,60.36 55.07,60.35 | C2.2 37.37,34.01 IC1.9 47.83,34.01 v48.97,35.15 | 19.69,23.9 RSW1.M2 19.69,25.16 | S1.4 S1.3 | C3.2 C4.2 51.41,25.04 52.27,25.91 52.27,26.67 51.41,27.53 51.41,27.64 | R5.1 10.82,41.59 | U$1.30 22.06,46.84 21.17,47.73 20.02,47.73 19.52,47.23 U$1.28 19.52,45.25 17.3,43.03 | U$1.36 29.84,46.34 29.84,52.2 v28.78,52.58 | R5.1 R1.1 14.19,40.95 14.5,40.59 16.99,40.59 17.3,40.89 17.3,43.03 | 17.3,43.03 15.67,44.65 15.67,46.13 U$1.25 | 51.41,27.64 IC1.25 | RSW1.C 8.69,26.33 RSW1.M1 | U$1.10 18.26,67.35 | 89.46,28.14 89.28,28.14 | U$1.19 8.09,45.86 6.93,44.7 6.93,41.1 7.47,40.56 10.41,40.56 10.85,41 10.85,41.62 R5.1 | v55.3,61.42 55.09,62.61 55.04,62.66 | C25.2 11.78,69.54 10.64,68.4 10.64,67.38 | 10.64,67.38 U$1.16 | 10.64,67.38 10.64,65.96 10.13,65.46 8.97,65.46 8.08,66.34 8.08,67.36 U$1.18 | X1.3 72.27,33.15 S2.3 | 55.1,34.92 v54.86,35.15 54.86,34.54 54.9,34.51 IC1.41 | 51.41,27.64 51.21,27.43 49.17,27.43 48.91,27.7 IC1.20 48.91,29.49 47.4,31 IC1.15 | IC4.7 50.93,53.16 50.6,52.83 50.6,52.22 | C5.2 61.8,30.3 61.37,29.87 63.4,29.87 v63.43,29.98 | v63.6,26.21 63.4,26.01 63.8,25.6 | v66.04,27.03 65.84,27.03
  Top 0.406: C20.2 89.29,17.51 | 89.41,17.53 89.92,18.29 89.92,27.43 89.46,28.14 | 83.87,28.14 89.28,28.14 88.49,27.36 | 84.23,6.81 84.23,6.5 84.78,6.5 C11.1 | 75.53,6.77 C11.1 | C10.1 84.78,6.79 C11.1 | 75.53,6.77 71.77,6.77 C8.1 69.77,8.81 | 75.53,6.77 C9.1 | C7.1 48.03,8.74 | RSW1.SW2 21.05,12.97
  Bottom 0.254: LECTOR-HEADER.1 92.32,30.68 | 88.49,27.36 89.76,28.63 | v58.57,55.78 58.57,55.91 v55.3,61.42 | v48.97,35.15 48.97,35.76 | v63.6,26.21 61.37,29.06 | v63.43,29.98 63.6,29.46 v66.04,27.03
  other vias: 66.29,33.73 89.76,30.68 3.86,35.94 39.24,41.76 5.56,49.5 79.63,30.76 60.76,19.74 56.16,15.01 73.63,17.27 84.35,13.36 21.77,57.07 13.36,64.64 13,54.81 21.46,49.3 28.32,56.77 37.87,62.05 75.13,55.78 79.43,45.06 66.32,49.99 37.26,33.68 71.88,43.43 85.83,50.93 20.07,69.72 31.45,69.47 31.34,57.73 83.82,30.73 94.41,27.41 28.65,29.87 3.86,24.38 9.75,28.65 31.7,28.85 33.93,28.85 47.35,31.09 53.04,23.98 46.53,19.51 81.05,57.73 51,52.22 69.49,21.13 78.64,21.13 60.35,43.48 60.15,41.86 76.4,71.53 69.9,67.87 69.49,71.32 4.06,4.27 101.18,4.27 101.18,68.82 11.58,9.14 79.43,42.42 2.84,44.09 4.06,15.65 4.27,9.35 42.27,17.48 42.67,2.64 71.53,2.64 93.68,2.44 81.08,18.29 101.8,20.73 101.8,36.78 101.8,56.08 79.25,48.16 35.15,43.89 69.29,7.72 73.96,25.6 55.88,41.05 57.91,46.33 49.17,38 94.67,30.71 94.67,42.01
  pour Bottom: 28.47,71.37 32.18,71.37 28.45,71.32
  pour Bottom: 94.21,71.63 94.21,71.42 94.36,71.42 97.64,68.15
  pour Top (isolate 0.61): 0.13,73.18 105.44,73.18 105.44,-0.2 0.13,0
  pour Bottom (isolate 0.61): -0.41,73 105.44,73.33 104.9,-0.18 0.2,-0.18
LCD_A0  (via drill 0.51)
  Top 0.254: LCD.38 39.3,12.03 v39.3,14.75 | IC1.37 55.27,32.51 v54.66,31.9
  Bottom 0.254: v39.3,14.75 39.47,14.91 39.47,17.79 53.58,31.9 v54.66,31.9
LCD_CS
  Top 0.254: IC1.36 56.04,32.01 55.68,31.5 55.68,24.46 46.86,15.65 35.76,15.65 34.2,14.09 LCD.40
LCD_SCL
  Top 0.254: LCD.37 41.82,13.58 43.08,14.83 51.82,14.83 56.86,19.88 IC1.33
LCD_SI
  Top 0.254: 44.36,12.87 LCD.36 44.36,13.28 45.31,14.22 52.07,14.22 59.54,21.69 59.54,29.06 57.58,31.01 IC1.34
MCLR  (via drill 0.51)
  Top 0.254: IC1.7 46.39,35.01 v47.12,35.74 | v47.12,35.74 47.22,35.84 47.22,37.59 47.12,37.69 | v47.12,35.74 47.12,37.69 | 47.12,37.69 43.59,41.22 43.59,51.27 S1.2 | v43.43,28.75 44.7,28.75 45.29,28.17 45.29,25.88 37.08,17.67 R16.1 | R16.1 32.85,17.65 | R16.1 32.92,17.59 32.92,15.04 26.82,8.94 25.14,8.94 ICSP.1
  Bottom 0.254: v47.12,35.74 47.07,35.69 47.07,32.38 v43.43,28.75
N$1
  Top 0.254: R1.2 15.89,43.24 15.24,43.89 11.48,43.89 10.64,44.73 10.64,46.15 U$1.21 10.59,46.2 10.59,48.97 19.52,57.9 U$1.9
N$2
  Bottom 0.254: PWR.A 92.45,9.18 R3.2
N$3  (via drill 0.51)
  Top 0.254: U$1.4 25.87,65.11 v25.83,65.08 | v29.97,41.55 28.18,41.55 R2.2
  Bottom 0.254: v25.83,65.08 25.83,52.12 27.94,50.01 27.94,43.59 v29.97,41.55
N$5  (via drill 0.51)
  other vias: 94.28,6.91
N$6
  Top 0.178: R15.1 34.29,49.54
  Top 0.254: LCD.1 34.29,55.13 34.29,49.54
N$9
  Top 0.254: C6.1 48.74,46.61 51.44,43.92 51.44,39.99 IC1.56
N$10
  Top 0.254: R4.1 36.74,50.13 LCD.2
N$11
  Top 0.254: R10.1 64.33,63.22 USB.A
N$12
  Top 0.254: 36.73,10.31 36.74,10.31
  Top 0.406: C7.2 R11.1 40.35,6.7 36.73,10.31 | 36.74,10.31 LCD.39
N$13
  Bottom 0.254: R14.2 95.87,13.03 DATA.A
N$14
  Bottom 0.254: WIFI.A 92.49,16.69 R13.2
N$15
  Top 0.254: IC4.15 60.12,48.55 58.35,48.55 56.72,50.18 56.72,65.23 | 56.72,65.23 56.72,65.44 | 56.72,65.23 CONN1.D+
N$16
  Top 0.254: IC4.16 60.04,49.4 58.48,49.4 57.46,50.43 CONN1.D-
N$17  (via drill 0.51)
  Top 0.254: 61.75,49.91 IC4.17 | 61.75,49.91 62.73,49.91 C14.1 C15.1 | v61.75,47.75 61.75,49.91 | IC4.4 51.92,55.11 51.46,55.58 51.46,57.71 v52.2,58.45
  Bottom 0.254: v61.75,47.75 56.44,53.06 56.44,56.62 54.61,58.45 v52.2,58.45
N$18
  Top 0.254: LCD.3 40.04,54.46 R9.1
N$21
  Top 0.254: 72.31,9.34 LCD.25
  Top 0.406: C8.2 72.31,9.34
N$22
  Top 0.254: 74.84,9.52 LCD.24
  Top 0.406: C9.2 74.84,9.52
N$23
  Top 0.254: 77.39,11.31 LCD.23
  Top 0.406: C10.2 77.39,11.31
N$24
  Top 0.254: 83.59,8.77 83.18,8.77 LCD.22
  Top 0.406: 83.59,8.77 C11.2
N$25
  Top 0.254: C12.2 83.68,12.03 LCD.21
N$26
  Top 0.254: C16.2 66.76,11.57 LCD.27
N$27
  Top 0.406: C16.1 64.69,8.8 LCD.28
N$28
  Top 0.406: C17.2 62.94,8.7 62.94,10.52 62.15,11.31 LCD.29
N$29
  Top 0.254: LCD.30 60.01,12.03 61.07,10.98
  Top 0.406: 61.07,10.98 C17.1 58.95,6.71 C19.1
N$30
  Top 0.254: C18.2 52.97,10.48 LCD.32
N$31
  Top 0.254: C19.2 57.06,9.19 LCD.31
N$34
  Top 0.254: X1.12 76.77,33.69 77.72,34.65 77.72,37.34 S2.2
OSCI
  Top 0.254: C22.1 68.23,37.71 Y1.P$3 69.67,34.98 70.31,34.34 70.31,31.9 69.7,31.29 63.8,31.29 62.99,32.11 62.99,32.72 62.38,33.33 59.13,33.33 58.93,33.53 56.88,33.53 IC1.39
OSCO
  Top 0.254: C21.1 62.94,37.04 62.94,34.14 | 62.94,34.14 62.94,33.78 63.8,32.92 64.39,32.92 Y1.P$2 | IC1.40 59.58,34.01 59.81,33.78 62.59,33.78 62.94,34.14
OUT4  (via drill 0.51)
  Top 0.254: 49.94,28.59 IC1.22 49.91,30.36 v49.89,30.38
  Bottom 0.254: v49.89,30.38 49.89,32.51 50.65,33.27 50.71,33.28 62.45,33.28 79.01,16.72 R13.1
OUT5  (via drill 0.51)
  Top 0.254: v50.7,31.39 50.7,30.4 50.39,29.36 50.39,28.58 IC1.23
  Bottom 0.254: v50.7,31.39 50.7,32.26 51.1,32.66 62.03,32.66 78.64,16.05 87.74,16.05 R14.1
PGC  (via drill 0.51)
  Top 0.254: IC1.17 47.41,27.6 47.09,27.28 v46.74,27.28
  Bottom 0.254: v46.74,27.28 45.51,27.28 41.39,23.16 26.21,23.16 14.96,11.91 ICSP.5
PGD  (via drill 0.51)
  Top 0.254: v46.13,25.6 46.94,25.6 47.91,26.57 IC1.18
  Bottom 0.254: ICSP.4 17.5,13.23 26.42,22.15 42.67,22.15 v46.13,25.6
RXLED  (via drill 0.51)
  Top 0.254: USB.C 64.36,67.54 v64.34,67.56 | IC4.22 v62.23,53.16 | IC4.22
  Bottom 0.254: v64.34,67.56 64.34,55.27 v62.23,53.16
SOSCI  (via drill 0.89)
  Top 0.254: IC1.47 58.27,37.51 Y3.P$2 61.8,41.05 68.81,41.05 68.95,41.19 | C24.1 67.88,42.97 Y2.P$4 68.95,41.19 | v65.95,41.25 68.95,41.25 68.95,41.19
SOSCO  (via drill 0.89)
  Top 0.254: C23.1 56.86,42.62 IC1.48 | C23.1 56.49,42.99 56.49,44.09 57.15,44.75 68.68,44.75 | Y3.P$1 56.54,42.59 C23.1 | 68.68,44.75 Y2.P$1 | v64.56,44.76 68.68,44.76 68.68,44.75
USB-CTS
  Top 0.254: IC1.52 53.41,45.3 51.21,47.5 51.21,49.94 51.82,50.55 52.85,50.55 IC4.11
USB-RTS
  Top 0.254: IC1.51 53.91,46.49 54.76,47.35 54.76,55.07 54.05,55.78 52.89,55.78 IC4.3
USB-RX  (via drill 0.51)
  Top 0.254: IC1.50 54.41,46.18 55.52,47.3 55.52,55.52 v54.91,56.13 | v51.31,54.46 IC4.5
  Bottom 0.254: v54.91,56.13 52.98,56.13 v51.31,54.46
USB-TX
  Top 0.254: IC1.49 54.91,45.97 56.19,47.24 56.19,56.69 55.78,57.1 52.91,57.1 IC4.1
VEXT
  Top 0.813: J1.VIN0 76.81,68.79 76.81,59.59 75.43,58.2 JP1.1
ZG-CE  (via drill 0.51)
  Top 0.254: U$1.20 9.21,46.02 | R5.2 9.19,46 U$1.20 | IC1.2 39.96,37.51 v39.22,38.25 | v27.79,37.57 9.09,37.57 5.13,41.53 5.13,45.77 7.29,47.93 8.84,47.93 9.35,47.42 9.35,46.17 U$1.20
  Bottom 0.254: v39.22,38.25 28.47,38.25 v27.79,37.57
ZG-INT  (via drill 0.51)
  Top 0.254: IC1.14 42.61,31.51 v37.24,26.14 | 25.91,46.21 U$1.33 25.88,46.15 25.88,44.27 23.27,41.66 R6.1 21.92,41.6 v21.92,40.11
  Bottom 0.254: v37.24,26.14 25.65,26.14 24.13,27.66 24.13,37.9 v21.92,40.11
ZG-RST
  Top 0.254: U$1.7 22.05,67.36 22.05,65.43 31.11,56.36 31.11,44.86 31.11,44.85 31.11,44.1 38.21,37.01 IC1.3
ZG-SCK
  Top 0.254: U$1.34 27.15,46.18 | U$1.34 27.1,46.2 | U$1.34 27.14,47.48 27.1,47.52 27.1,53.95 27.94,54.79 29.54,54.79 30.58,53.75 30.58,43.99 38.06,36.51 IC1.4
ZG-SCS  (via drill 0.51)
  Top 0.254: IC1.8 34.41,34.51 31.85,32.08 v22.61,32.08 | 13.16,46.17 U$1.23 13.18,46.18 v13.18,48.23
  Bottom 0.254: v22.61,32.08 22.61,37.57 14.73,45.44 14.73,46.69 v13.18,48.23
ZG-SDI
  Top 0.254: IC1.5 37.88,36.01 29.92,43.97 29.18,43.97 28.42,44.73 28.42,46.15 U$1.35
ZG-SDO  (via drill 0.51)
  Top 0.254: IC1.6 37.36,35.51 29.74,43.13 v26.57,43.13 | 24.59,46.16 U$1.32 24.64,46.21 v24.64,48.18
  Bottom 0.254: v26.57,43.13 26.57,46.25 v24.64,48.18
ZG-URX  (via drill 0.51)
  Top 0.254: IC1.12 45.11,32.51 45.01,32.49 42.27,32.49 36.12,26.42 26.95,26.42 26.34,27.03 v26.21,27.03 | v16.97,48.34 16.97,46.17 U$1.26
  Bottom 0.254: v16.97,48.34 25.4,39.9 25.4,27.84 v26.21,27.03
ZG-UTX  (via drill 0.51)
  Top 0.254: IC1.11 41.7,33.01 35.87,27.18 27.38,27.18 v27.36,27.28 | U$1.27 18.26,46.18 | U$1.27 18.31,46.23 | v18.24,48.49 18.24,46.17 U$1.27
  Bottom 0.254: v27.36,27.28 27.36,27.53 26.31,28.57 26.31,40.41 v18.24,48.49

### Text on the board
bPlace: v. ß2 | Adolfo Bucay | Tofi Buzali | David Gómez Urquiza | 11/2011
tNames: GND | +5V | TX | Y2 | RX | RTS | CTS | GND | PGC | PGD | GND | +3V3 | MCLR